# Altium project IR.PrjPCB
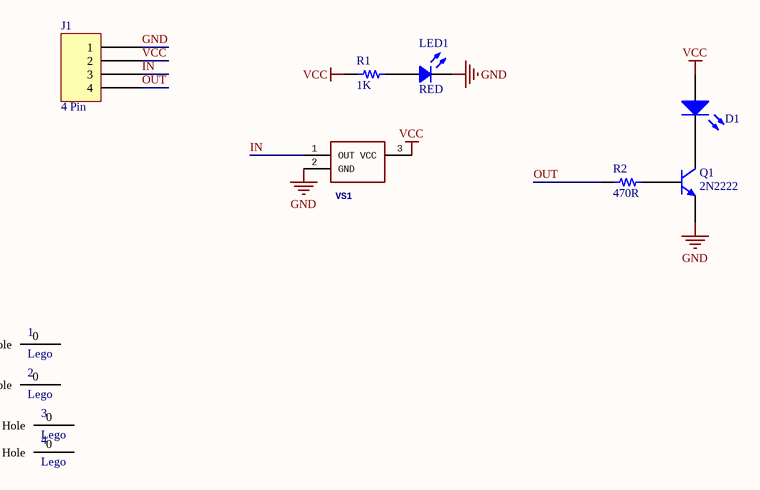
[diagram p0: IR.SchDoc]
1 sheet, 11 parts. Net scope: global (net labels, ports and power ports of the same name join across sheets).
Board file: IR.PcbDoc

## Sheet IR.SchDoc
size A

### Parts
1  Lego  [Lego Hole]
2  Lego  [Lego Hole]
3  Lego  [Lego Hole]
4  Lego  [Lego Hole]
D1  LED 5mm  [LED-1]  (value not drawn)
J1  4 Pin  [JST XH B4B-XH-A - RIGHT]
LED1  RED  [LED 0805/2012 RED]
Q1  2N2222  [SOT23]
R1  1K  [RES 1206/3216]
R2  470R  [RES 1206/3216]
VS1  (no value)  [VS1838]

### Nets
GND: J1.1 LED1.2 Q1.E VS1.2(GND)
VCC: D1.1(A) J1.2 R1.2 VS1.3(VCC)
IN: J1.3 VS1.1(OUT)
OUT: J1.4 R2.2
NetD1_2: D1.2(K) Q1.C
NetLED1_1: LED1.1 R1.1
NetQ1_B: Q1.B R2.1

Not connected (* = marked no-connect by the designer): 1 0(Lego_Hole); 2 0(Lego_Hole); 3 0(Lego_Hole); 4 0(Lego_Hole)

### Library data of the parts
D1 = LED 5mm: Typical LED; Designer: Seyed Mohsen Ghasemian; Published: 07/31/2012; PackageReference: LED; Publisher: www.picpars.com; PackageDescription: LED; 2 Leads
LED1 = LED: Chip LED; Value: Green
Q1 = 2N2222: NPN; E-mail: picpars@gmail.com; De: Seyed Mohsen Ghasemian; web: www.picpars.com
R1 = Resistor: SMT Resistor; Value: 1K
R2 = Resistor: SMT Resistor; Value: 1K
VS1 = VS1838: Manufacturer_Name: Honeywell; GateName_1: G$1; SymbolName_1: SS49E-T3; Allied_Number: 70238630; LibraryName: SS49E-T3; DeviceSetName: SS49E-T3; Package: TO130P160X410X300-3P; Supplier_Name: RS; RS_Part_Number: 8749069; Manufacturer_Part_Number: SS49E-T3; Height: 1.6mm